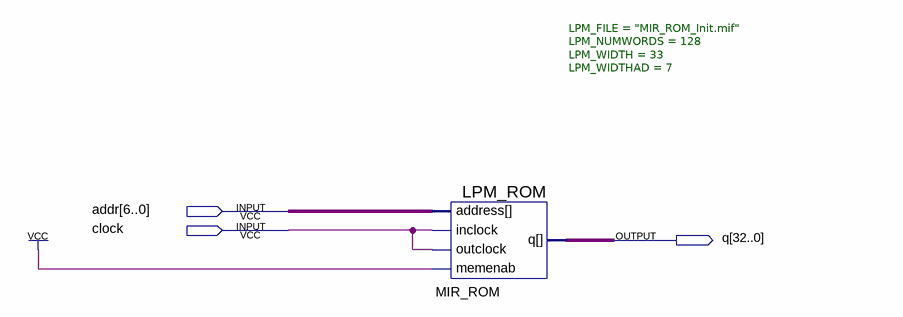
[diagram p0: schematic sheet]
// Quartus schematic MIR_ROM.bdf as structural Verilog: 1 symbols, 3 pins
module MIR_ROM (
  input  [6:0] addr,
  input  clock,
  output [32:0] q
);

  LPM_ROM #(.LPM_FILE("MIR_ROM_Init.mif"), .LPM_NUMWORDS(128), .LPM_WIDTH(33), .LPM_WIDTHAD(7)) MIR_ROM (
    .address(addr), .inclock(clock), .outclock(clock), .memenab(1'b1), .q(q));
endmodule
